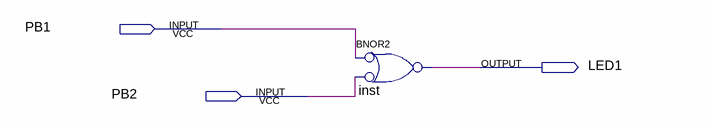
[diagram p0: schematic sheet]
// Quartus schematic orgate.bdf as structural Verilog: 1 symbols, 3 pins
module orgate (
  input  PB1,
  input  PB2,
  output LED1
);

  nor inst (LED1, ~PB1, ~PB2);  // BNOR2
endmodule
